# EAGLE design PSU board (EAGLE 6.5.0)
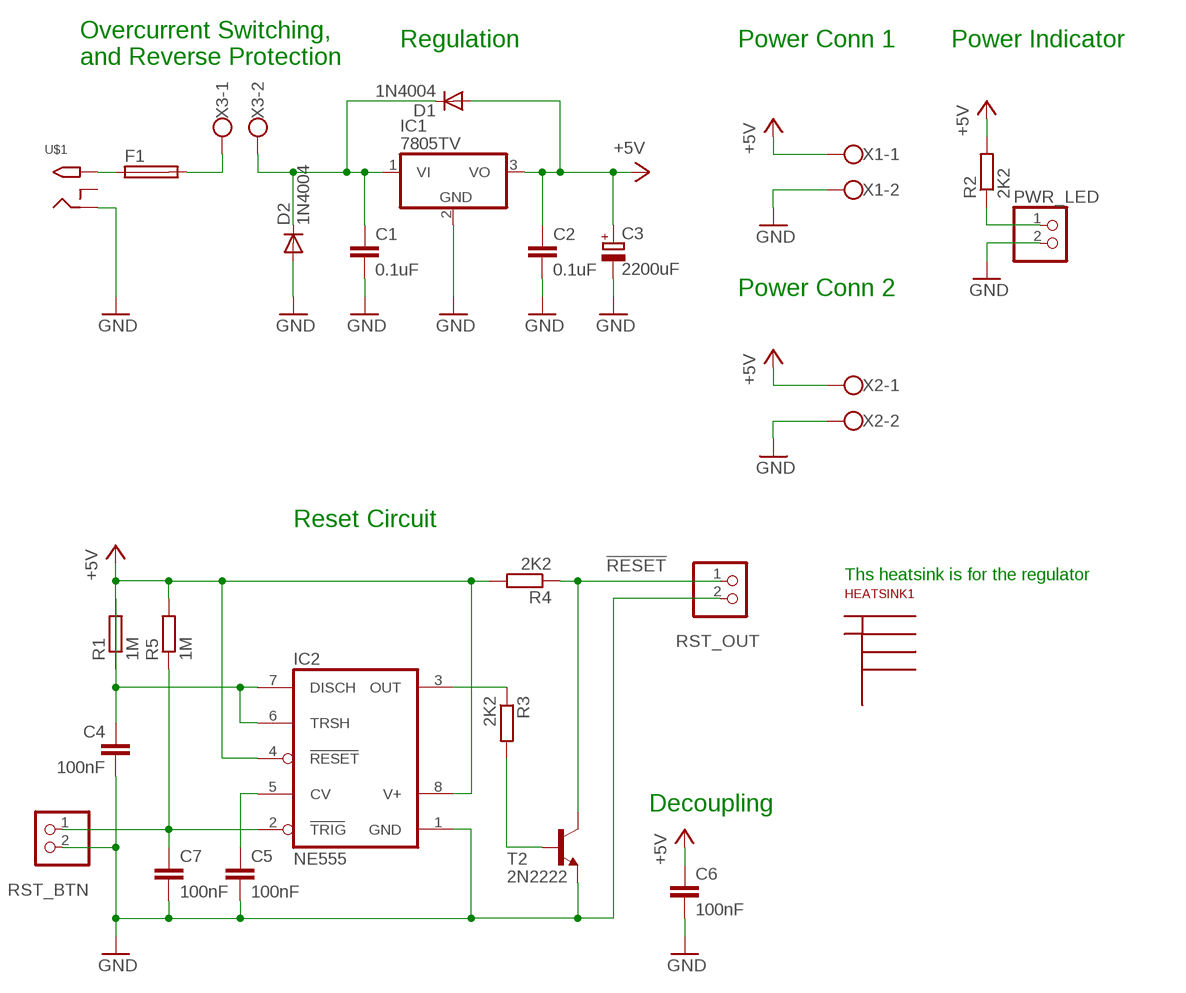
[diagram p0: schematic, sheet 1]

## Parts
C1  0.1uF  C-EU025-025X050  [C025-025X050]
C2  0.1uF  C-EU025-025X050  [C025-025X050]
C3  2200uF  CPOL-EUE7.5-18  [E7,5-18]
C4  100nF  C-EU025-025X050  [C025-025X050]
C5  100nF  C-EU025-025X050  [C025-025X050]
C6  100nF  C-EU025-025X050  [C025-025X050]
C7  100nF  C-EU025-025X050  [C025-025X050]
D1  1N4004  [DO41-10]
D2  1N4004  [DO41-10]
F1  SH22,5A  [SH22,5A]
HEATSINK1  FISCHER-50_HSINK  [FISHER-50]
IC1  7805TV  [TO220V]
IC2  NE555  ICM7555  [DIL08]
PWR_LED  PINHD-1X2  [1X02]
R1  1M  R-EU_0207/2V  [0207/2V]
R2  2K2  R-EU_0207/10  [0207/10]
R3  2K2  R-EU_0207/2V  [0207/2V]
R4  2K2  R-EU_0207/2V  [0207/2V]
R5  1M  R-EU_0207/10  [0207/10]
RST_BTN  PINHD-1X2  [1X02]
RST_OUT  PINHD-1X2  [1X02]
T2  2N2222  [TO18]
U$1  2.1MMJACKTHM  [PJ-102A]
X1  W237-102  [W237-102]
X2  W237-102  [W237-102]
X3  W237-102  [W237-102]

## Nets
!RESET: R4.1 RST_OUT.1 T2.3(C)
+5V [ppbus_logic]: C2.1 C3.+ C6.1 D1.A IC1.3(VO) IC2.4(RESET) IC2.8(V+) R1.1 R2.2 R4.2 R5.2 X1.1 X2.1
+V_IN: C1.1 D1.C D2.C IC1.1(VI) X3.2
GND [ppbus_logic]: C1.2 C2.2 C3.- C4.2 C5.2 C6.2 C7.2 D2.A IC1.2(GND) IC2.1(GND) PWR_LED.2 RST_BTN.2 RST_OUT.2 T2.1(E) U$1.RING X1.2 X2.2
N$2: PWR_LED.1 R2.1
N$3: F1.2 X3.1
N$16: F1.1 U$1.TIP
N$21: C4.1 IC2.6(TRSH) IC2.7(DISCH) R1.2
N$23: C5.1 IC2.5(CV)
N$24: C7.1 IC2.2(TRIG) R5.1 RST_BTN.1
N$26: R3.2 T2.2(B)
N$27: IC2.3(OUT) R3.1
Unconnected: U$1.RING_SW

## Notes on the sheet
- Regulation | Power Conn 1 | Power Indicator
- Overcurrent Switching,
  and Reverse Protection
- Power Conn 2
- Reset Circuit
- Ths heatsink is for the regulator
- Decoupling

## Library data of the parts
C1 C2 C4-C7 = rcl:C-EU: CAPACITOR, European symbol
C3 = rcl:CPOL-EU: POLARIZED CAPACITOR, European symbol
D1 D2 = adafruit:1N4004: DIODE General purpose 1N400x type rectifier (With bigger pads) http://www.ladyada.net/library/pcb/eaglelibrary.html
F1 = fuse:SH22,5A: FUSE HOLDER grid 22,5mm, isolated cap OGN0031 8201, Schurter (Buerklin); MPN: 0031.7701.11; OC_FARNELL: unknown; OC_NEWARK: 04F1224
HEATSINK1 = Dunc's heatsinks:FISCHER-50_HSINK
IC1 = linear:78*: Positive VOLTAGE REGULATOR Source: http://cache.national.com/ds/LM/LM78L05.pdf http://www.fairchildsemi.com/ds/LM/LM7805.pdf
IC2 = maxim:ICM7555: TIMER
PWR_LED RST_BTN RST_OUT = pinhead:PINHD-1X2: PIN HEADER
R1-R5 = rcl:R-EU_: RESISTOR, European symbol
T2 = transistor:2N2222: NPN TRANSISTOR
U$1 = adafruit:2.1MMJACK: 2.1mm x 5.5mm THM DC jack with internal switch. Digikey part #PJ-102A, 4UCON part #05537 2.1mm x 5.5mm SMT DC jack with internal switch. Digikey part #PJ-002A-SMT, 4UCON part #03267 By microbuilder.eu & adafruit.com
X1-X3 = con-wago-500:W237-102: WAGO SCREW CLAMP; MPN: 237-102; OC_FARNELL: unknown; OC_NEWARK: 70K9898

## Net classes
1 ppbus_logic: width 0.61 mm, clearance 0.203 mm

## Board
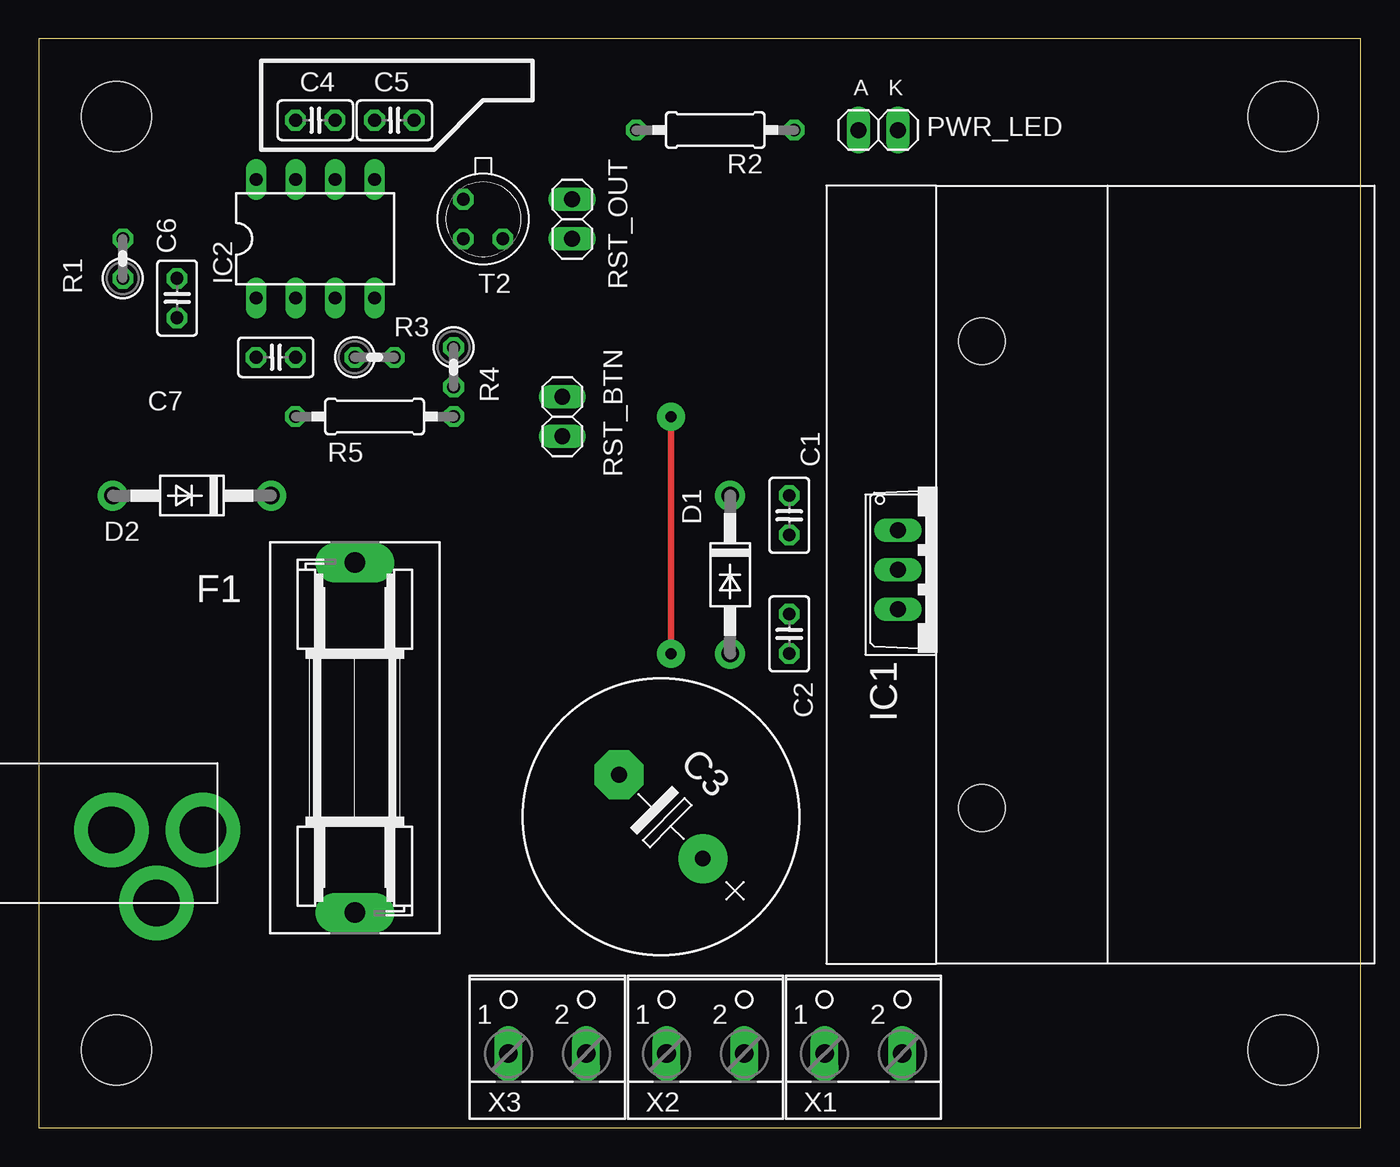
[diagram p1: board, top side]
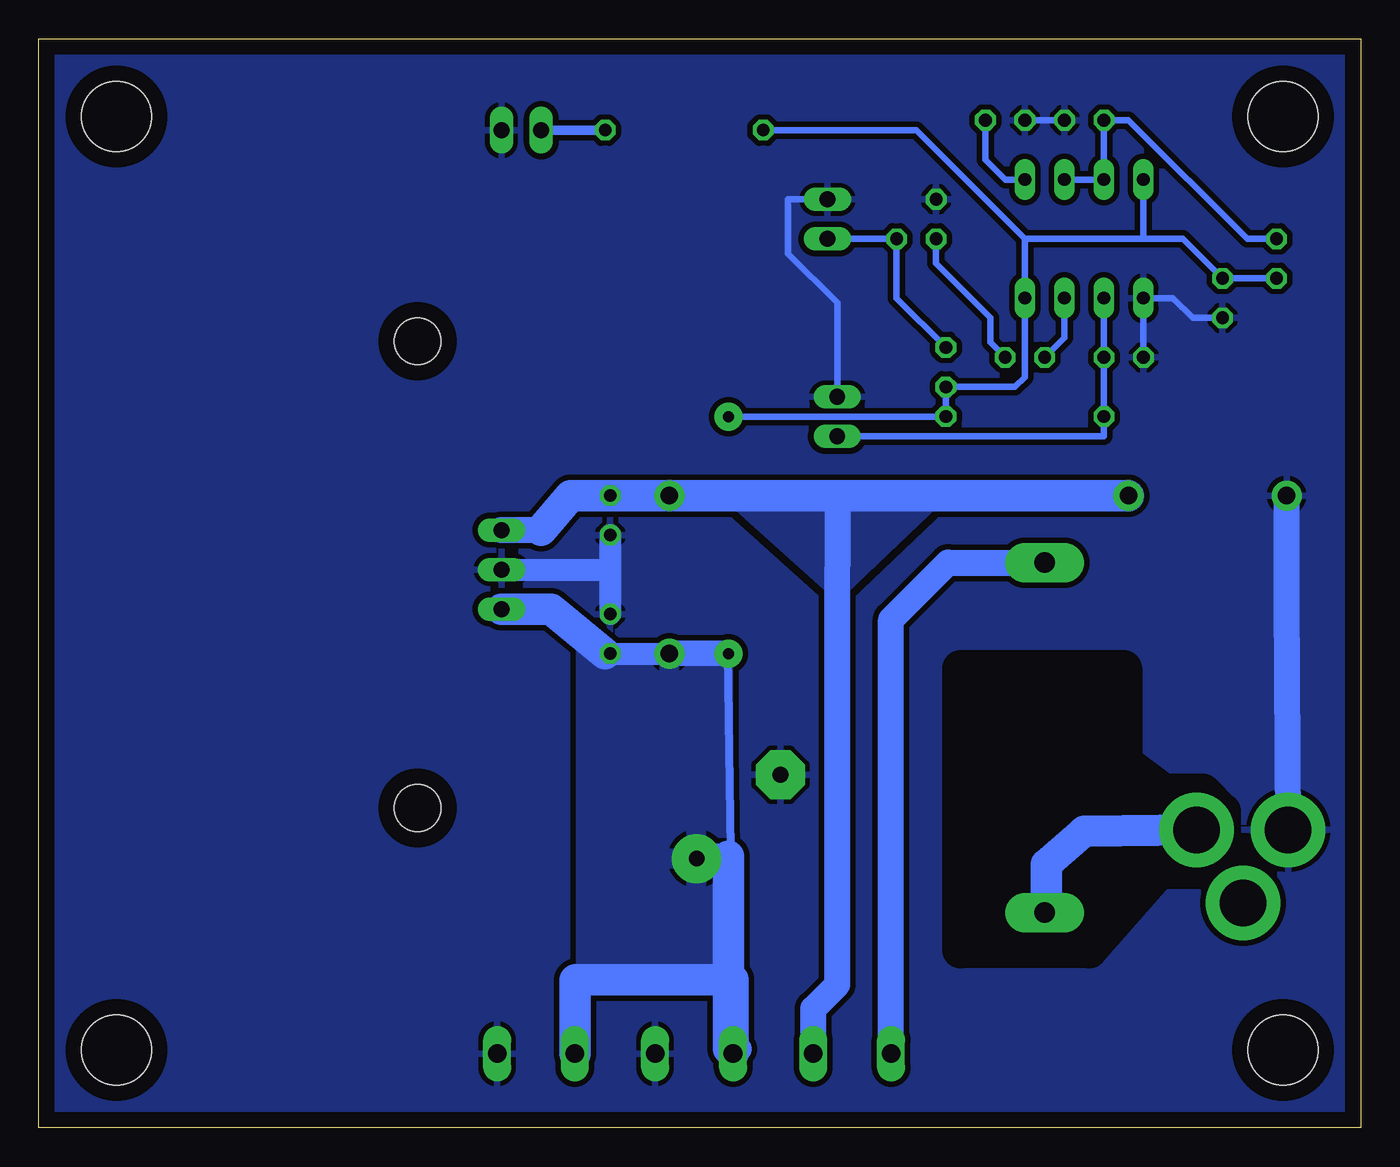
[diagram p2: board, bottom side, seen from below]

Size 85 x 70 mm. Coordinates in mm from the lower left corner, seen from the top.
Outline: 0,0 85,0 85,70 0,70 0,0
Copper layers (1*16): Top 0.035mm / dielectric 1.5mm / Bottom 0.035mm
Design rules "default *": minimum track width 10mil, minimum drill 24mil, track to track 10mil, track to pad 10mil, pad to pad 10mil, via to via 10mil, smd to smd 8mil, copper to edge 40mil, drill to drill 8mil, minimum pad ring 10mil, minimum via ring 8mil, stop-mask expansion 4mil, vias tented up to drill 0mil, thermal gap 12mil
Holes 4.5 mm at 5,5 80,5 5,65 80,65
bRestrict: area 8.9,11.4 to 25.7,29.5

### Footprints (pad centres in the part's own frame; a part is rotated, then mirrored left to right if it is on the bottom)
C025-025X050 = drill 0.813 octagon: 1 -1.27,0; 2 1.27,0
E7,5-18 = drill 1.016 pad 3.15: + -3.81,0 | drill 1.016 pad 3.15 octagon: - 3.81,0
DO41-10 = drill 1.118 pad 1.93: A 5.08,0; C -5.08,0
SH22,5A = drill 1.321 pad 2.54 long: 1 -11.252,0; 2 11.252,0
FISHER-50 = hole 3: -15,0; 15,0
TO220V = drill 1.016 long: 1 -2.54,-2.54; 2 0,-2.54; 3 2.54,-2.54
DIL08 = drill 0.813 long: 1 -3.81,-3.81; 2 -1.27,-3.81; 3 1.27,-3.81; 4 3.81,-3.81; 5 3.81,3.81; 6 1.27,3.81; 7 -1.27,3.81; 8 -3.81,3.81
1X02 = drill 1.016 long: 1 -1.27,0; 2 1.27,0
0207/2V = drill 0.813 octagon: 1 -1.27,0; 2 1.27,0
0207/10 = drill 0.813 octagon: 1 -5.08,0; 2 5.08,0
TO18 = drill 0.813 octagon: 1 -1.27,-1.27; 2 1.27,-1.27; 3 1.27,1.27
PJ-102A = drill 3 pad 4.8: RING 0.1,-3.39; RING_SW -4.6,-6.29; TIP 0.1,-9.29
W237-102 = drill 1.194 long: 1 -2.5,-1.27; 2 2.5,-1.27

### Placement (x,y rotation side)
C1  48.26,39.37 270 top
C2  48.26,31.75 90 top
C3  40.01,20 135 top
C4  17.78,64.77 0 top
C5  22.86,64.77 180 top
C6  8.89,53.34 270 top
C7  15.24,49.53 180 top
D1  44.45,35.56 270 top
D2  9.84,40.64 180 top
F1  20.32,25.08 90 top
HEATSINK1  60.64,35.56 270 top
IC1  57.78,35.88 270 top
IC2  17.78,57.15 0 top
PWR_LED  53.98,64.14 0 top
R1  5.4,55.88 90 top
R2  43.5,64.14 180 top
R3  21.59,49.53 0 top
R4  26.67,48.9 270 top
R5  21.59,45.72 0 top
RST_BTN  33.66,45.72 90 top
RST_OUT  34.29,58.42 90 top
T2  28.57,58.42 270 top
U$1  1.27,19.05 90 top
X1  53.02,6.03 0 top
X2  42.86,6.03 0 top
X3  32.7,6.03 0 top

### Tracks (layer width: path | path; a pad name or v marks a point on that pad's centre or on a via)
!RESET
  Bottom 0.406: RST_OUT.1 T2.3 29.84,53.34 R4.1
+5V  (via drill 0.7 pad 1.8)
  Top 0.406: v40.64,30.48 v40.64,45.72
  Bottom 0.406: R1.1 C6.1 11.43,57.15 13.97,57.15 | 21.59,57.15 IC2.4 21.59,48.26 22.23,47.62 R4.2 R5.2 v40.64,45.72 | 21.59,57.15 13.97,57.15 | 21.59,57.15 28.57,64.14 R2.2 | D1.A v40.64,30.48 | IC2.8 13.97,57.15
  Bottom 0.508: 40.36,9.53 40.68,30.52
  Bottom 1.422: 48.58,30.48 C2.1 D1.A
  Bottom 1.676: 40.68,30.52 D1.A | 50.52,9.48 50.48,9.53 | C3.+ 42.55,17.46 40.64,17.46 | 40.64,5.08 40.01,5.08
  Bottom 2.032: IC1.3 52.07,33.34 48.58,30.48 | X2.1 40.36,9.53 50.48,9.53 | X1.1 50.52,9.48 | 40.64,17.46 40.64,5.08
  pour Bottom (isolate 0.356): 49.85,9.53 40.96,9.53 40.96,30.48 49.85,30.48
+V_IN
  Bottom 1.676: 52.7,38.42 IC1.1 | X3.2 35.2,7.66 33.66,9.21 33.66,31.43 33.62,40.68 34.61,40.64
  Bottom 2.032: 52.7,38.42 50.8,40.64 C1.1 D1.C 34.61,40.64 D2.C
  pour Bottom (isolate 0.356): 40.01,40.64 27.62,40.64 33.66,34.92
GND
  Bottom 0.406: C4.2 C5.2 | C6.2 10.79,52.07 12.06,53.34 IC2.1 C7.2 | RST_BTN.2 33.66,53.02 36.83,56.2 36.83,59.69 RST_OUT.2
  Bottom 1.422: IC1.2 48.26,35.88 | C1.2 48.26,35.88 | 48.26,35.88 C2.2
  Bottom 1.676: U$1.RING 4.76,33.97 D2.A
  pour Bottom (isolate 0.356, rank 2): 0,69.85 85.41,69.85 85.41,0 0,0
N$2
  Bottom 0.61: R2.1 PWR_LED.1
N$3
  Bottom 1.676: X3.1 30.2,32.66 26.53,36.34 F1.2
N$16
  Bottom 2.032: U$1.TIP 17.78,19.05 20.22,16.93 20.22,14.07 20.32,13.97 F1.1
N$21
  Bottom 0.406: IC2.6 IC2.7 C4.1 14.92,64.77 7.3,57.15 R1.2
N$23
  Bottom 0.406: IC2.5 22.86,60.96 24.13,62.23 C5.1
N$24
  Bottom 0.406: IC2.2 C7.1 R5.1 16.51,44.45 RST_BTN.1
N$26
  Bottom 0.406: R3.2 23.81,50.48 23.81,52.07 27.3,55.56 T2.2
N$27
  Bottom 0.406: IC2.3 19.05,50.8 R3.1

### Text on the board
tNames: A | K
tValues: GND | !RST